# Altium schematic sheet main.SchDoc
size A4
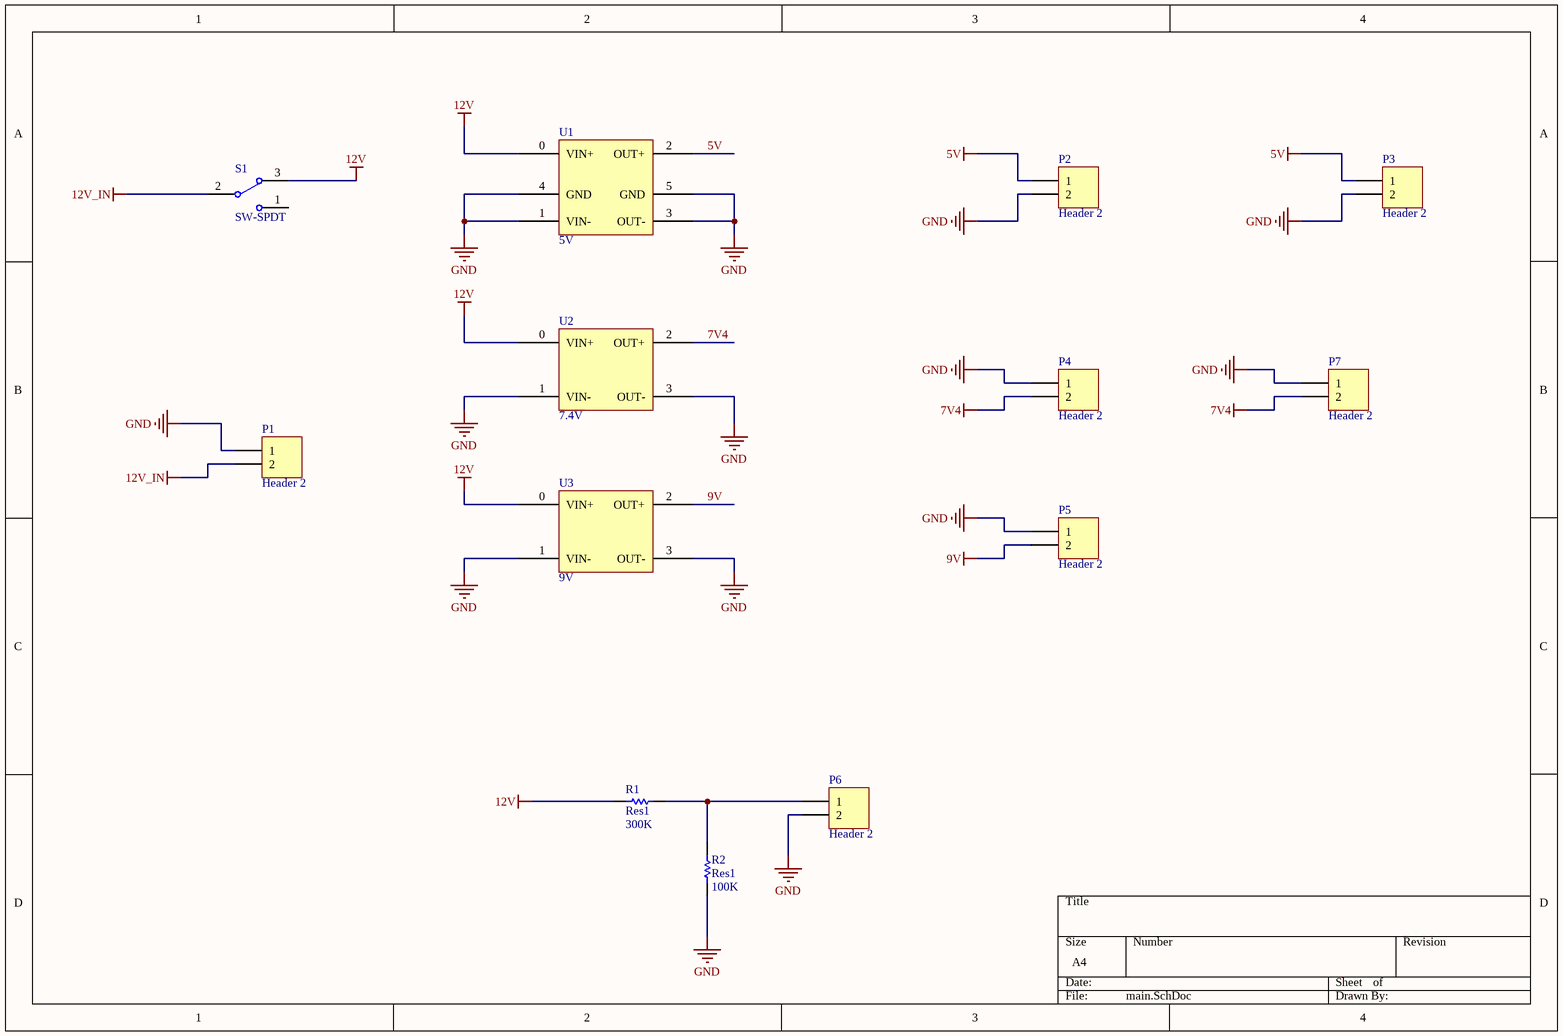
[diagram p0: main.SchDoc]

## Parts
P1  Header 2  [CONN-TH_XT30UPB-M]
P2  Header 2  [XH2.54-2A]
P3  Header 2  [XH2.54-2A]
P4  Header 2  [XH2.54-2A]
P5  Header 2  [XH2.54-2A]
P6  Header 2  [XH2.54-2A]
P7  Header 2  [XH2.54-2A]
R1  Res1  value 300K  [R0603]
R2  Res1  value 100K  [R0603]
S1  SW-SPDT  [switch]
U1  5V  [5V_8A]
U2  7.4V  [PCBComponent_1]
U3  9V  [PCBComponent_1]

## Nets
5V: P2.1 P3.1 U1.2(OUT+)
7V4: P4.2 P7.2 U2.2(OUT+)
9V: P5.2 U3.2(OUT+)
12V: R1.2 S1.3 U1.0(VIN+) U2.0(VIN+) U3.0(VIN+)
12V_IN: P1.2 S1.2
GND: P1.1 P2.2 P3.2 P4.1 P5.1 P6.2 P7.1 R2.1 U1.1(VIN-) U1.3(OUT-) U1.4(GND) U1.5(GND) U2.1(VIN-) U2.3(OUT-) U3.1(VIN-) U3.3(OUT-)
NetP6_1: P6.1 R1.1 R2.2

Not connected (* = marked no-connect by the designer): S1 1

## Library data of the parts
P1-P7 = Header 2: Header, 2-Pin; LatestRevisionDate: 17-Jul-2002; LatestRevisionNote: Re-released for DXP Platform.; Publisher: Altium Limited
R1 R2 = Res1: Resistor; Published: 8-Jun-2000; LatestRevisionDate: 17-Jul-2002; LatestRevisionNote: Re-released for DXP Platform.; PackageReference: AXIAL-0.3; Publisher: Altium Limited; PackageDescription: Axial Device, Thru-Hole; 2 Leads; 0.3 in Pin Spacing
S1 = SW-SPDT: SPDT Subminiature Toggle Switch, Right Angle Mounting, Vertical Actuation; Published: 24-Mar-1999; LatestRevisionDate: 17-Dec-2003; LatestRevisionNote: Schematic revised, PCB Footprint replaced.; DatasheetVersion: 05-Dec-2000; PackageReference: TL36WW15050; Publisher: Altium Limited; PackageDescription: Switch; 4 Leads; ComponentLink1Description: Manufacturer Link; ComponentLink1URL: http://www.apem.com
U1 = 5V_8A
U2 = 7_4V